# Altium schematic sheet CPU_ETH.SchDoc: CPU ETH
size A3; SheetNumber: 11; SheetTotal: 21
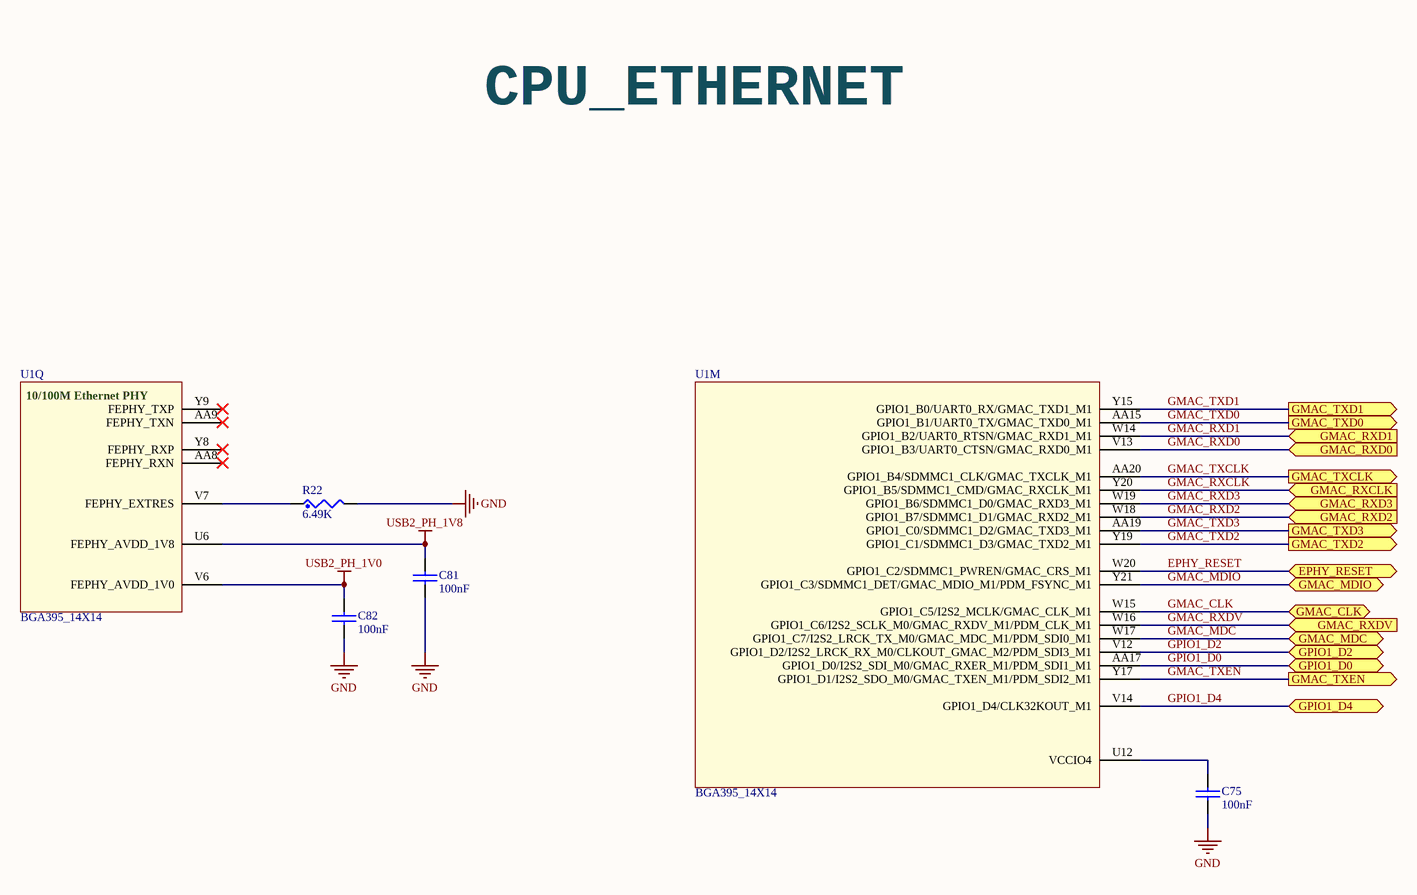
[diagram p0: CPU_ETH.SchDoc]

## Parts
C75  100nF  [0402_CC - C]
C81  100nF  [0402_CC - C]
C82  100nF  [0402_CC - C]
R22  6.49K  [0402_CR]
U1  BGA395_14X14  [BGA395C65P21X21_1750X1750X117]  (parts M,Q of 17)

## Ports
EPHY_RESET (bidir), GMAC_CLK (bidir), GMAC_MDC (bidir), GMAC_MDIO (bidir), GMAC_RXCLK (in), GMAC_RXD0 (in), GMAC_RXD1 (in), GMAC_RXD2 (in), GMAC_RXD3 (in), GMAC_RXDV (in), GMAC_TXCLK (out), GMAC_TXD0 (out), GMAC_TXD1 (out), GMAC_TXD2 (out), GMAC_TXD3 (out), GMAC_TXEN (out), GPIO1_D0 (bidir), GPIO1_D2 (bidir), GPIO1_D4 (bidir)

## Nets
GND: C75.1 C81.2 C82.2 R22.2
USB2_PH_1V0: C82.1 U1.V6(FEPHY_AVDD_1V0)
USB2_PH_1V8: C81.1 U1.U6(FEPHY_AVDD_1V8)
EPHY_RESET: U1.W20(GPIO1_C2/SDMMC1_PWREN/GMAC_CRS_M1) ; port EPHY_RESET
GMAC_CLK: U1.W15(GPIO1_C5/I2S2_MCLK/GMAC_CLK_M1) ; port GMAC_CLK
GMAC_MDC: U1.W17(GPIO1_C7/I2S2_LRCK_TX_M0/GMAC_MDC_M1/PDM_SDI0_M1) ; port GMAC_MDC
GMAC_MDIO: U1.Y21(GPIO1_C3/SDMMC1_DET/GMAC_MDIO_M1/PDM_FSYNC_M1) ; port GMAC_MDIO
GMAC_RXCLK: U1.Y20(GPIO1_B5/SDMMC1_CMD/GMAC_RXCLK_M1) ; port GMAC_RXCLK
GMAC_RXD0: U1.V13(GPIO1_B3/UART0_CTSN/GMAC_RXD0_M1) ; port GMAC_RXD0
GMAC_RXD1: U1.W14(GPIO1_B2/UART0_RTSN/GMAC_RXD1_M1) ; port GMAC_RXD1
GMAC_RXD2: U1.W18(GPIO1_B7/SDMMC1_D1/GMAC_RXD2_M1) ; port GMAC_RXD2
GMAC_RXD3: U1.W19(GPIO1_B6/SDMMC1_D0/GMAC_RXD3_M1) ; port GMAC_RXD3
GMAC_RXDV: U1.W16(GPIO1_C6/I2S2_SCLK_M0/GMAC_RXDV_M1/PDM_CLK_M1) ; port GMAC_RXDV
GMAC_TXCLK: U1.AA20(GPIO1_B4/SDMMC1_CLK/GMAC_TXCLK_M1) ; port GMAC_TXCLK
GMAC_TXD0: U1.AA15(GPIO1_B1/UART0_TX/GMAC_TXD0_M1) ; port GMAC_TXD0
GMAC_TXD1: U1.Y15(GPIO1_B0/UART0_RX/GMAC_TXD1_M1) ; port GMAC_TXD1
GMAC_TXD2: U1.Y19(GPIO1_C1/SDMMC1_D3/GMAC_TXD2_M1) ; port GMAC_TXD2
GMAC_TXD3: U1.AA19(GPIO1_C0/SDMMC1_D2/GMAC_TXD3_M1) ; port GMAC_TXD3
GMAC_TXEN: U1.Y17(GPIO1_D1/I2S2_SDO_M0/GMAC_TXEN_M1/PDM_SDI2_M1) ; port GMAC_TXEN
GPIO1_D0: U1.AA17(GPIO1_D0/I2S2_SDI_M0/GMAC_RXER_M1/PDM_SDI1_M1) ; port GPIO1_D0
GPIO1_D2: U1.V12(GPIO1_D2/I2S2_LRCK_RX_M0/CLKOUT_GMAC_M2/PDM_SDI3_M1) ; port GPIO1_D2
GPIO1_D4: U1.V14(GPIO1_D4/CLK32KOUT_M1) ; port GPIO1_D4
NetC75_2: C75.2 U1.U12(VCCIO4)
NetR22_1: R22.1 U1.V7(FEPHY_EXTRES)

Not connected (* = marked no-connect by the designer): U1 AA8(FEPHY_RXN)* AA9(FEPHY_TXN)* Y8(FEPHY_RXP)* Y9(FEPHY_TXP)*

## Notes on the sheet
- CPU_ETHERNET
- (in symbol RK3328, part Q) 10/100M Ethernet PHY

## Library data of the parts
C75 C81 C82 = CAP_NP: CLASS: DISCRETE
R22 = RES: CLASS: DISCRETE
U1 = RK3328: By AAR